# Altium schematic sheet Trackpoint.SchDoc
size Letter; CompanyName: Ploopy Corporation; Organization: Ploopy Corporation; Address1: 137-1140 Burnhamthorpe Road W; Address2: Mississauga; Address3: Ontario; Address4: Canada L5C 0A3; DocumentNumber: 1; Revision: R1.001; SheetNumber: 1; SheetTotal: 7
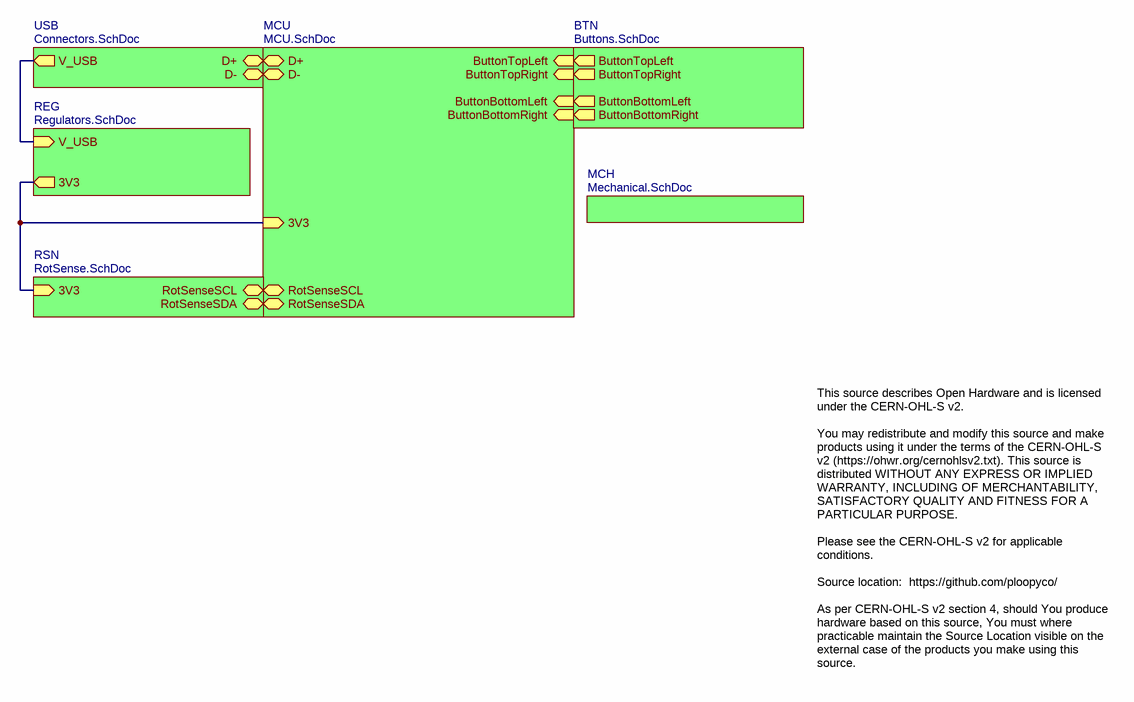
[diagram p0: Trackpoint.SchDoc]

## Sub-sheets
BTN = Buttons.SchDoc: ButtonTopLeft (out), ButtonBottomRight (out), ButtonBottomLeft (out), ButtonTopRight (out)
MCH = Mechanical.SchDoc: no entries
MCU = MCU.SchDoc: D+ (bidir), D- (bidir), ButtonTopLeft (in), 3V3 (in), ButtonTopRight (in), ButtonBottomRight (in), ButtonBottomLeft (in), RotSenseSCL (bidir), RotSenseSDA (bidir)
REG = Regulators.SchDoc: 3V3 (out), V_USB (in)
RSN = RotSense.SchDoc: 3V3 (in), RotSenseSCL (bidir), RotSenseSDA (bidir)
USB = Connectors.SchDoc: D+ (bidir), V_USB (out), D- (bidir)

## Nets
(unnamed): sheet USB/D+, sheet MCU/D+
(unnamed): sheet USB/V_USB, sheet REG/V_USB
(unnamed): sheet USB/D-, sheet MCU/D-
(unnamed): sheet REG/3V3, sheet MCU/3V3, sheet RSN/3V3
(unnamed): sheet MCU/ButtonTopLeft, sheet BTN/ButtonTopLeft
(unnamed): sheet MCU/ButtonTopRight, sheet BTN/ButtonTopRight
(unnamed): sheet MCU/ButtonBottomRight, sheet BTN/ButtonBottomRight
(unnamed): sheet MCU/ButtonBottomLeft, sheet BTN/ButtonBottomLeft
(unnamed): sheet MCU/RotSenseSCL, sheet RSN/RotSenseSCL
(unnamed): sheet MCU/RotSenseSDA, sheet RSN/RotSenseSDA

## Notes on the sheet
- This source describes Open Hardware and is licensed under the CERN-OHL-S v2.
  You may redistribute and modify this source and make products using it under the terms of the CERN-OHL-S v2 (https://ohwr.org/cernohlsv2.txt). This source is distributed WITHOUT ANY EXPRESS OR IMPLIED WARRANTY, INCLUDING OF MERCHANTABILITY, SATISFACTORY QUALITY AND FITNESS FOR A PARTICULAR PURPOSE.
  Please see the CERN-OHL-S v2 for applicable conditions.
  Source location:  https://github.com/ploopyco/
  As per CERN-OHL-S v2 section 4, should You produce hardware based on this source, You must where practicable maintain the Source Location visible on the external case of the products you make using this source.
- Copyright Ploopy Corporation
- Licensed under the CERN-OHL-S v2
- http://ohwr.org/cernohl
- Title:
- PCB:
- Version:
- Ploopy Corporation
- Mississauga ON L5C 0A3
- 137-1140 Burnhamthorpe Road W
- Date:
- Time:
- Sheet
- of
- Canada